# EAGLE schematic od2_redraw (EAGLE 8.5.1)
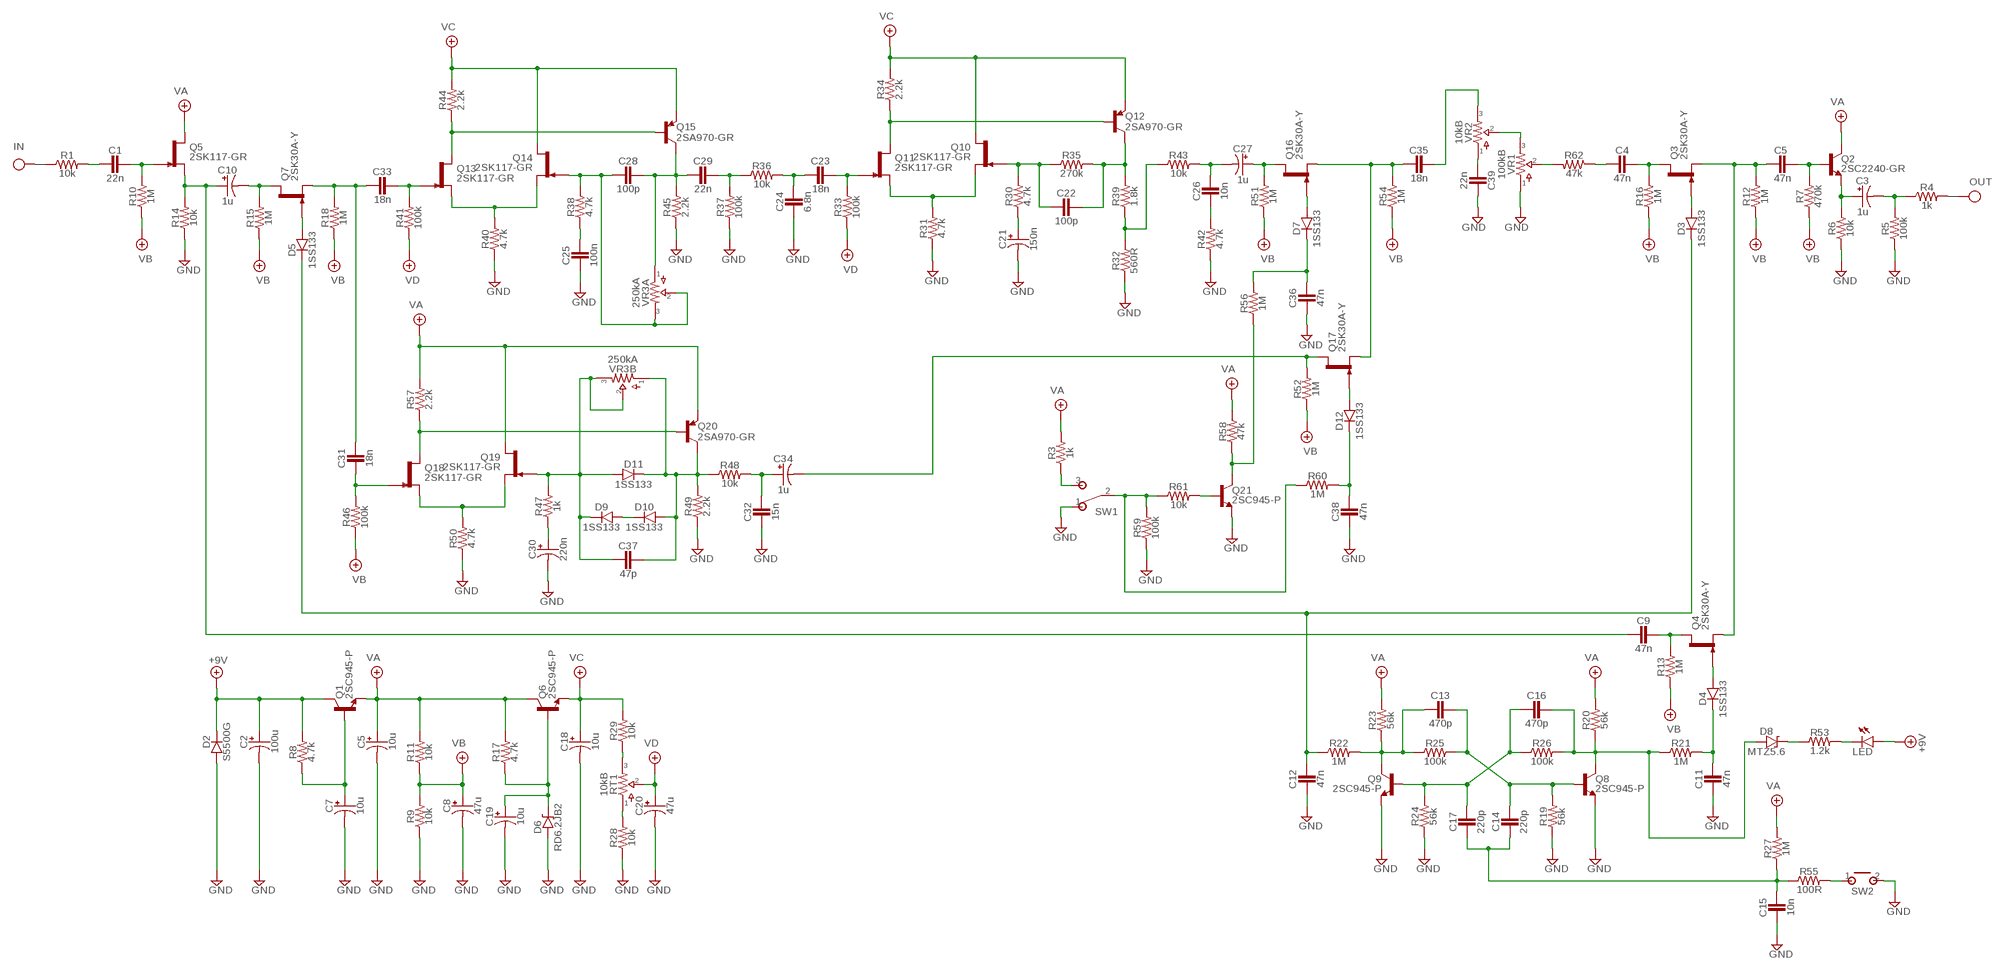
[diagram p0: schematic, sheet 1]

## Parts
C1  22n  CER/FILMBOX.1  [BOX_SMALL]
C2  100u  0400  [040_020]
C3  1u  0400  [040_020]
C4  47n  CER/FILMBOX.1  [BOX_SMALL]
C5  10u  0400  [040_020]
C5   47n  CER/FILMBOX.1  [BOX_SMALL]
C7  10u  0400  [040_020]
C8  47u  0400  [040_020]
C9  47n  CER/FILMBOX.1  [BOX_SMALL]
C10  1u  0400  [040_020]
C11  47n  CER/FILMBOX.1  [BOX_SMALL]
C12  47n  CER/FILMBOX.1  [BOX_SMALL]
C13  470p  CER/FILMBOX.1  [BOX_SMALL]
C14  220p  CER/FILMBOX.1  [BOX_SMALL]
C15  10n  CER/FILMBOX.1  [BOX_SMALL]
C16  470p  CER/FILMBOX.1  [BOX_SMALL]
C17  220p  CER/FILMBOX.1  [BOX_SMALL]
C18  10u  0400  [040_020]
C19  10u  0400  [040_020]
C20  47u  0400  [040_020]
C21  150n  0400  [040_020]
C22  100p  CER/FILMBOX.1  [BOX_SMALL]
C23  18n  CER/FILMBOX.1  [BOX_SMALL]
C24  6.8n  CER/FILMBOX.1  [BOX_SMALL]
C25  100n  CER/FILMBOX.1  [BOX_SMALL]
C26  10n  CER/FILMBOX.1  [BOX_SMALL]
C27  1u  0400  [040_020]
C28  100p  CER/FILMBOX.1  [BOX_SMALL]
C29  22n  CER/FILMBOX.1  [BOX_SMALL]
C30  220n  0400  [040_020]
C31  18n  CER/FILMBOX.1  [BOX_SMALL]
C32  15n  CER/FILMBOX.1  [BOX_SMALL]
C33  18n  CER/FILMBOX.1  [BOX_SMALL]
C34  1u  0400  [040_020]
C35  18n  CER/FILMBOX.1  [BOX_SMALL]
C36  47n  CER/FILMBOX.1  [BOX_SMALL]
C37  47p  CER/FILMBOX.1  [BOX_SMALL]
C38  47n  CER/FILMBOX.1  [BOX_SMALL]
C39  22n  CER/FILMBOX.1  [BOX_SMALL]
D2  S5500G  DO35.2  [DO35-2]
D3  1SS133  DO35.2  [DO35-2]
D4  1SS133  DO35.2  [DO35-2]
D5  1SS133  DO35.2  [DO35-2]
D6  RD6.2JB2  ZENER.2  [DO41-2]
D7  1SS133  DO35.2  [DO35-2]
D8  MTZ5.6  ZENER.2  [DO41-2]
D9  1SS133  DO35.2  [DO35-2]
D10  1SS133  DO35.2  [DO35-2]
D11  1SS133  DO35.2  [DO35-2]
D12  1SS133  DO35.2  [DO35-2]
LED  LED  [3MM_D]
Q1  2SC945-P  2SC828A  [TO92-]
Q2  2SC2240-GR  2SC828A  [TO92-]
Q3  2SK30A-Y  2N3819TO-92S  [TO92-]
Q4  2SK30A-Y  2N3819TO-92S  [TO92-]
Q5  2SK117-GR  2N3819TO-92S  [TO92-]
Q6  2SC945-P  2SC828A  [TO92-]
Q7  2SK30A-Y  2N3819TO-92S  [TO92-]
Q8  2SC945-P  2SC828A  [TO92-]
Q9  2SC945-P  2SC828A  [TO92-]
Q10  2SK117-GR  2N3819TO-92S  [TO92-]
Q11  2SK117-GR  2N3819TO-92S  [TO92-]
Q12  2SA970-GR  2N3906  [TO92]
Q13  2SK117-GR  2N3819TO-92S  [TO92-]
Q14  2SK117-GR  2N3819TO-92S  [TO92-]
Q15  2SA970-GR  2N3906  [TO92]
Q16  2SK30A-Y  2N3819TO-92S  [TO92-]
Q17  2SK30A-Y  2N3819TO-92S  [TO92-]
Q18  2SK117-GR  2N3819TO-92S  [TO92-]
Q19  2SK117-GR  2N3819TO-92S  [TO92-]
Q20  2SA970-GR  2N3906  [TO92]
Q21  2SC945-P  2SC828A  [TO92-]
R1  10k  R_.3B  [R0207/3]
R3  1k  R_.3B  [R0207/3]
R4  1k  R_.3B  [R0207/3]
R5  100k  R_.3B  [R0207/3]
R6  10k  R_.3B  [R0207/3]
R7  470k  R_.3B  [R0207/3]
R8  4.7k  R_.3B  [R0207/3]
R9  10k  R_.3B  [R0207/3]
R10  1M  R_.3B  [R0207/3]
R11  10k  R_.3B  [R0207/3]
R12  1M  R_.3B  [R0207/3]
R13  1M  R_.3B  [R0207/3]
R14  10k  R_.3B  [R0207/3]
R15  1M  R_.3B  [R0207/3]
R16  1M  R_.3B  [R0207/3]
R17  4.7k  R_.3B  [R0207/3]
R18  1M  R_.3B  [R0207/3]
R19  56k  R_.3B  [R0207/3]
R20  56k  R_.3B  [R0207/3]
R21  1M  R_.3B  [R0207/3]
R22  1M  R_.3B  [R0207/3]
R23  56k  R_.3B  [R0207/3]
R24  56k  R_.3B  [R0207/3]
R25  100k  R_.3B  [R0207/3]
R26  100k  R_.3B  [R0207/3]
R27  1M  R_.3B  [R0207/3]
R28  10k  R_.3B  [R0207/3]
R29  10k  R_.3B  [R0207/3]
R30  4.7k  R_.3B  [R0207/3]
R31  4.7k  R_.3B  [R0207/3]
R32  560R  R_.3B  [R0207/3]
R33  100k  R_.3B  [R0207/3]
R34  2.2k  R_.3B  [R0207/3]
R35  270k  R_.3B  [R0207/3]
R36  10k  R_.3B  [R0207/3]
R37  100k  R_.3B  [R0207/3]
R38  4.7k  R_.3B  [R0207/3]
R39  1.8k  R_.3B  [R0207/3]
R40  4.7k  R_.3B  [R0207/3]
R41  100k  R_.3B  [R0207/3]
R42  4.7k  R_.3B  [R0207/3]
R43  10k  R_.3B  [R0207/3]
R44  2.2k  R_.3B  [R0207/3]
R45  2.2k  R_.3B  [R0207/3]
R46  100k  R_.3B  [R0207/3]
R47  1k  R_.3B  [R0207/3]
R48  10k  R_.3B  [R0207/3]
R49  2.2k  R_.3B  [R0207/3]
R50  4.7k  R_.3B  [R0207/3]
R51  1M  R_.3B  [R0207/3]
R52  1M  R_.3B  [R0207/3]
R53  1.2k  R_.3B  [R0207/3]
R54  1M  R_.3B  [R0207/3]
R55  100R  R_.3B  [R0207/3]
R56  1M  R_.3B  [R0207/3]
R57  2.2k  R_.3B  [R0207/3]
R58  47k  R_.3B  [R0207/3]
R59  100k  R_.3B  [R0207/3]
R60  1M  R_.3B  [R0207/3]
R61  10k  R_.3B  [R0207/3]
R62  47k  R_.3B  [R0207/3]
RT1  10kB  POTS16MM  [16MM]
SW1  SPDT  [M9040P]
SW2  MOMENTARY  [SPST]
VR1  100kB  POTS16MM  [16MM]
VR2  10kB  POTS16MM  [16MM]
VR3A  250kA  POTS16MM  [16MM]
VR3B  250kA  POTS16MM  [16MM]

## Nets
+9V: C2.+ D2.C LED.ANODE(A) Q1.2(C) R8.2
GND: C2.- C5.- C7.- C8.- C11.2 C12.2 C15.2 C18.- C19.- C20.- C21.- C24.2 C25.2 C30.- C32.2 C36.2 C38.2 C39.2 D2.A D6.A Q8.3(E) Q9.3(E) Q21.3(E) R5.1 R6.1 R9.1 R14.1 R19.1 R24.1 R28.1 R31.1 R32.1 R37.1 R40.1 R42.1 R45.1 R49.1 R50.1 R59.1 SW1.1(O) SW2.2(S) VR1.1
N$4: C7.+ Q1.1(B) R8.1
N$6: C19.+ D6.C Q6.1(B) R17.1
N$7: C1.2 R1.2
N$8: C1.1 Q5.2(G) R10.2
N$9: C10.- Q7.3(D) R15.2
N$10: D5.A Q7.2(G)
N$11: R29.1 RT1.3
N$12: R28.2 RT1.1
N$13: C31.1 C33.2 Q7.1(S) R18.2
N$14: C33.1 Q13.2(G) R41.2
N$15: Q13.1(S) Q14.1(S) R40.2
N$16: Q13.3(D) Q15.2(B) R44.1
N$17: C31.2 Q18.2(G) R46.2
N$18: C25.1 R38.1
N$19: C28.1 C29.2 Q15.1(C) R45.2 VR3A.1
N$20: C29.1 R36.1 R37.2
N$21: C23.2 C24.1 R36.2
N$22: C23.1 Q11.2(G) R33.2
N$23: Q10.1(S) Q11.1(S) R31.2
N$24: Q11.3(D) Q12.2(B) R34.1
N$25: C22.1 Q12.1(C) R35.2 R39.2
N$26: C26.1 C27.- R43.2
N$28: R32.2 R39.1 R43.1
N$29: C13.2 Q9.2(C) R22.2 R23.1 R25.1
N$30: C22.2 Q10.2(G) R30.2 R35.1
N$31: C16.1 D8.A Q8.2(C) R20.1 R21.1 R26.2
N$32: C16.2 C17.1 Q9.1(B) R24.2 R26.1
N$33: C21.+ R30.1
N$34: C13.1 C14.1 Q8.1(B) R19.2 R25.2
N$35: C14.2 C15.1 C17.2 R27.1 R55.1
N$36: C26.2 R42.2
N$37: C27.+ Q16.3(D) R51.2
N$38: C35.2 Q16.1(S) Q17.1(S) R54.2
N$39: D7.A Q16.2(G)
N$40: C28.2 Q14.2(G) R38.2 VR3A.2 VR3A.3
N$41: R3.1 SW1.3(S)
N$42: Q18.1(S) Q19.1(S) R50.2
N$43: Q18.3(D) Q20.2(B) R57.1
N$44: C37.2 D9.C D11.A Q19.2(G) R47.2 VR3B.2 VR3B.3
N$45: C30.+ R47.1
N$46: C32.1 C34.+ R48.2
N$47: R59.2 R60.1 R61.1 SW1.2(P)
N$48: C37.1 D10.A D11.C Q20.1(C) R48.1 R49.2 VR3B.1
N$49: Q21.1(B) R61.2
N$50: D9.A D10.C
N$51: Q21.2(C) R56.1 R58.1
N$52: C39.1 VR2.1
N$53: C34.- Q17.3(D) R52.2
N$54: D12.A Q17.2(G)
N$55: C38.1 D12.C R60.2
N$56: VR1.3 VR2.2
N$57: C36.1 D7.C R56.2
N$58: R62.2 VR1.2
N$59: C4.2 R62.1
N$60: C35.1 VR2.3
N$61: D4.A Q4.2(G)
N$62: C11.1 D4.C R21.2
N$63: C9.1 Q4.3(D) R13.2
N$64: C4.1 Q3.3(D) R16.2
N$65: D3.A Q3.2(G)
N$66: R55.2 SW2.1(P)
N$67: C5 .2 Q3.1(S) Q4.1(S) R12.2
N$68: C5 .1 Q2.1(B) R7.2
N$69: C3.+ Q2.3(E) R6.2
N$70: C3.- R4.1 R5.2
N$72: C12.1 D3.C D5.C R22.1
N$73: D8.C R53.1
N$74: LED.P$1(C) R53.2
N$111: C9.2 C10.+ Q5.1(S) R14.2
VA: C5.+ Q1.3(E) Q2.2(C) Q5.3(D) Q6.2(C) Q19.3(D) Q20.3(E) R3.2 R11.2 R17.2 R20.2 R23.2 R27.2 R57.2 R58.2
VB: C8.+ R7.1 R9.2 R10.1 R11.1 R12.1 R13.1 R15.1 R16.1 R18.1 R46.1 R51.1 R52.1 R54.1
VC: C18.+ Q6.3(E) Q10.3(D) Q12.3(E) Q14.3(D) Q15.3(E) R29.2 R34.2 R44.2
VD: C20.+ R33.1 R41.1 RT1.2
Unconnected: R1.1 R4.2

## Library data of the parts
C1 C4 C5  C9 C11-C17 C22-C26 C28 C29 C31-C33 C35-C39 = pedals-capacitors-film:CER/FILM: 47 - 120pF Xicon Ceramic Disc 2.5mm lead spacing
C2 C3 C5 C7 C8 C10 C18-C21 C27 C30 C34 = pedals-capacitors-elec:040
D2-D5 D7 D9-D12 = pedals-diodes:DO35: DO-35 Package Diodes: 1N914
D6 D8 = pedals-diodes:ZENER
LED = pedals-diodes:LED
Q1 Q2 Q6 Q8 Q9 Q21 = pedals-transistors:2SC828A
Q3-Q5 Q7 Q10 Q11 Q13 Q14 Q16-Q19 = pedals-transistors:2N3819: N-CHANNEL FET
Q12 Q15 Q20 = pedals-transistors:2N3906: PNP Transistor
R1 R3-R62 = pedals-resistors:R_
RT1 VR1 VR2 VR3A VR3B = pedals-potentiometers:POTS
SW1 = pedals-switches:SPDT: TOGGLE SWITCH Marquardt
SW2 = pedals-switches:MOMENTARY